# EAGLE design Kube_LoRaWAN_Module (EAGLE 9.6.2)
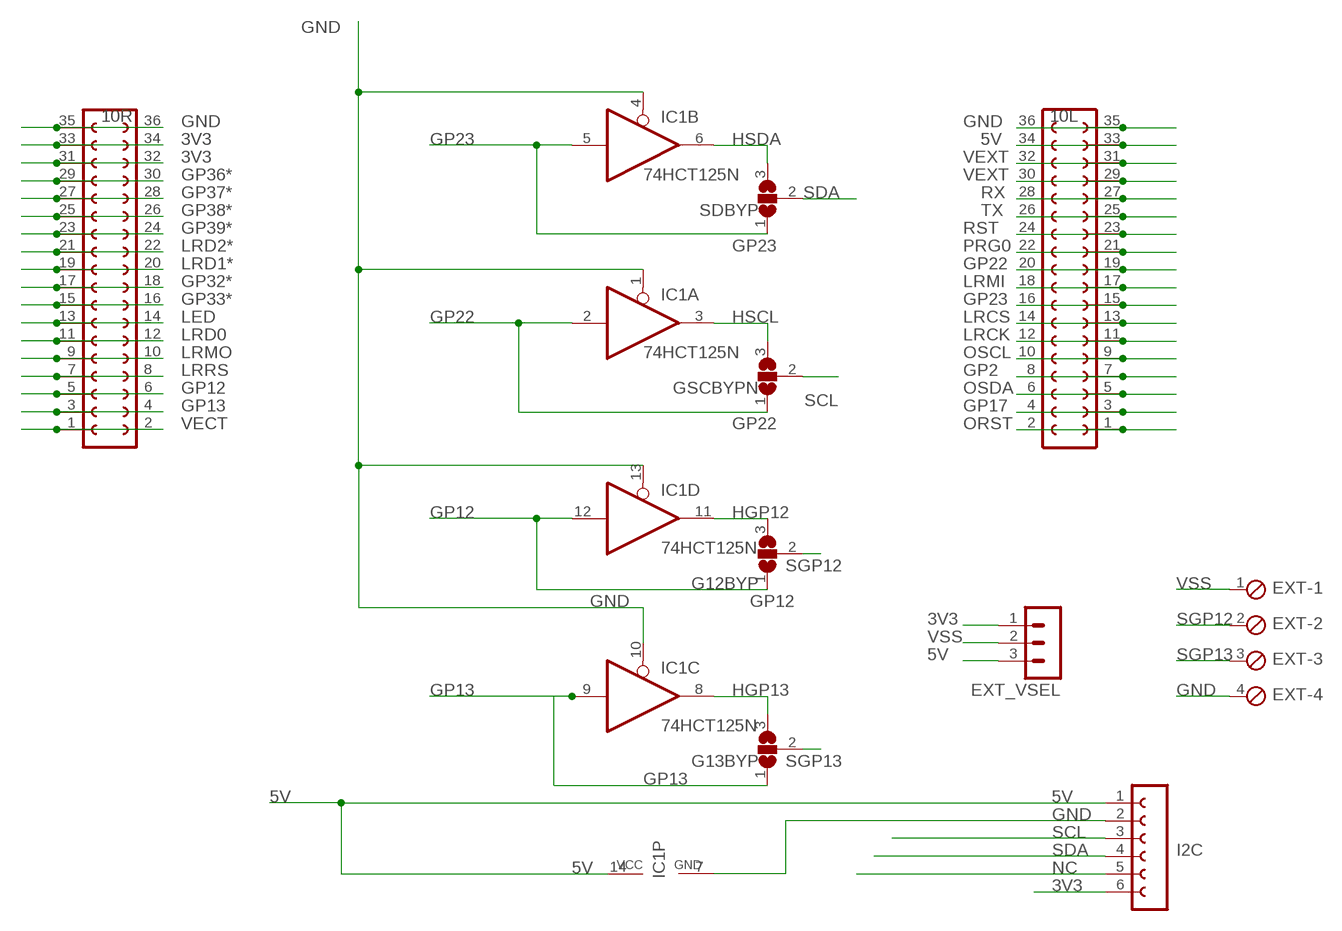
[diagram p0: schematic, sheet 1]

## Parts
10L  15  FE18-2  [FE18-2]
10R  15  FE18-2  [FE18-2]
EXT  MPT4  [4POL254]
EXT_VSEL  MA03-1  [MA03-1]
G12BYP  SJ2W  [SJ_2]
G13BYP  SJ2W  [SJ_2]
GSCBYPN  SJ2W  [SJ_2]
I2C  FE06-1  [FE06]
IC1  74HCT125N  [DIL14]
SDBYP  SJ2W  [SJ_2]

## Nets
3V3: 10R.31 10R.32 10R.33 10R.34 EXT_VSEL.1 I2C.6
5V: 10L.33 10L.34 EXT_VSEL.3 I2C.1 IC1.14(P:VCC)
GND: 10L.35 10L.36 10R.35 10R.36 EXT.4 I2C.2 IC1.1(A:OE) IC1.4(B:OE) IC1.7(P:GND) IC1.10(C:OE) IC1.13(D:OE)
GP2: 10L.7 10L.8
GP12: 10R.5 10R.6 G12BYP.1 IC1.12(D:I)
GP13: 10R.3 10R.4 G13BYP.1 IC1.9(C:I)
GP17: 10L.3 10L.4
GP22: 10L.19 10L.20 GSCBYPN.1 IC1.2(A:I)
GP23: 10L.15 10L.16 IC1.5(B:I) SDBYP.1
GP32*: 10R.17 10R.18
GP33*: 10R.15 10R.16
GP36*: 10R.29 10R.30
GP37*: 10R.27 10R.28
GP38*: 10R.25 10R.26
GP39*: 10R.23 10R.24
HGP12: G12BYP.3 IC1.11(D:O)
HGP13: G13BYP.3 IC1.8(C:O)
HSCL: GSCBYPN.3 IC1.3(A:O)
HSDA: IC1.6(B:O) SDBYP.3
LED: 10R.13 10R.14
LRCK: 10L.11 10L.12
LRCS: 10L.13 10L.14
LRD0: 10R.11 10R.12
LRD1*: 10R.19 10R.20
LRD2*: 10R.21 10R.22
LRMI: 10L.17 10L.18
LRMO: 10R.9 10R.10
LRRS: 10R.7 10R.8
NC: I2C.5
ORST: 10L.1 10L.2
OSCL: 10L.9 10L.10
OSDA: 10L.5 10L.6
PRG0: 10L.21 10L.22
RST: 10L.23 10L.24
RX: 10L.27 10L.28
SCL: GSCBYPN.2 I2C.3
SDA: I2C.4 SDBYP.2
SGP12: EXT.2 G12BYP.2
SGP13: EXT.3 G13BYP.2
TX: 10L.25 10L.26
VECT: 10R.1 10R.2
VEXT: 10L.29 10L.30 10L.31 10L.32
VSS: EXT.1 EXT_VSEL.2

## Library data of the parts
10L 10R = con-lsta:FE18-2: FEMALE HEADER; OC_FARNELL: unknown; OC_NEWARK: unknown
EXT = con-phoenix-254:MPT4: PHOENIX CONNECTOR; OC_FARNELL: unknown; OC_NEWARK: unknown
EXT_VSEL = con-lstb:MA03-1: PIN HEADER; OC_FARNELL: unknown; OC_NEWARK: unknown
G12BYP G13BYP GSCBYPN SDBYP = jumper:SJ2W: SMD solder JUMPER
I2C = con-lsta:FE06-1: FEMALE HEADER; OC_FARNELL: unknown; OC_NEWARK: unknown
IC1 = 74xx-eu:74*125: Quad bus BUFFER, 3-state

## Board
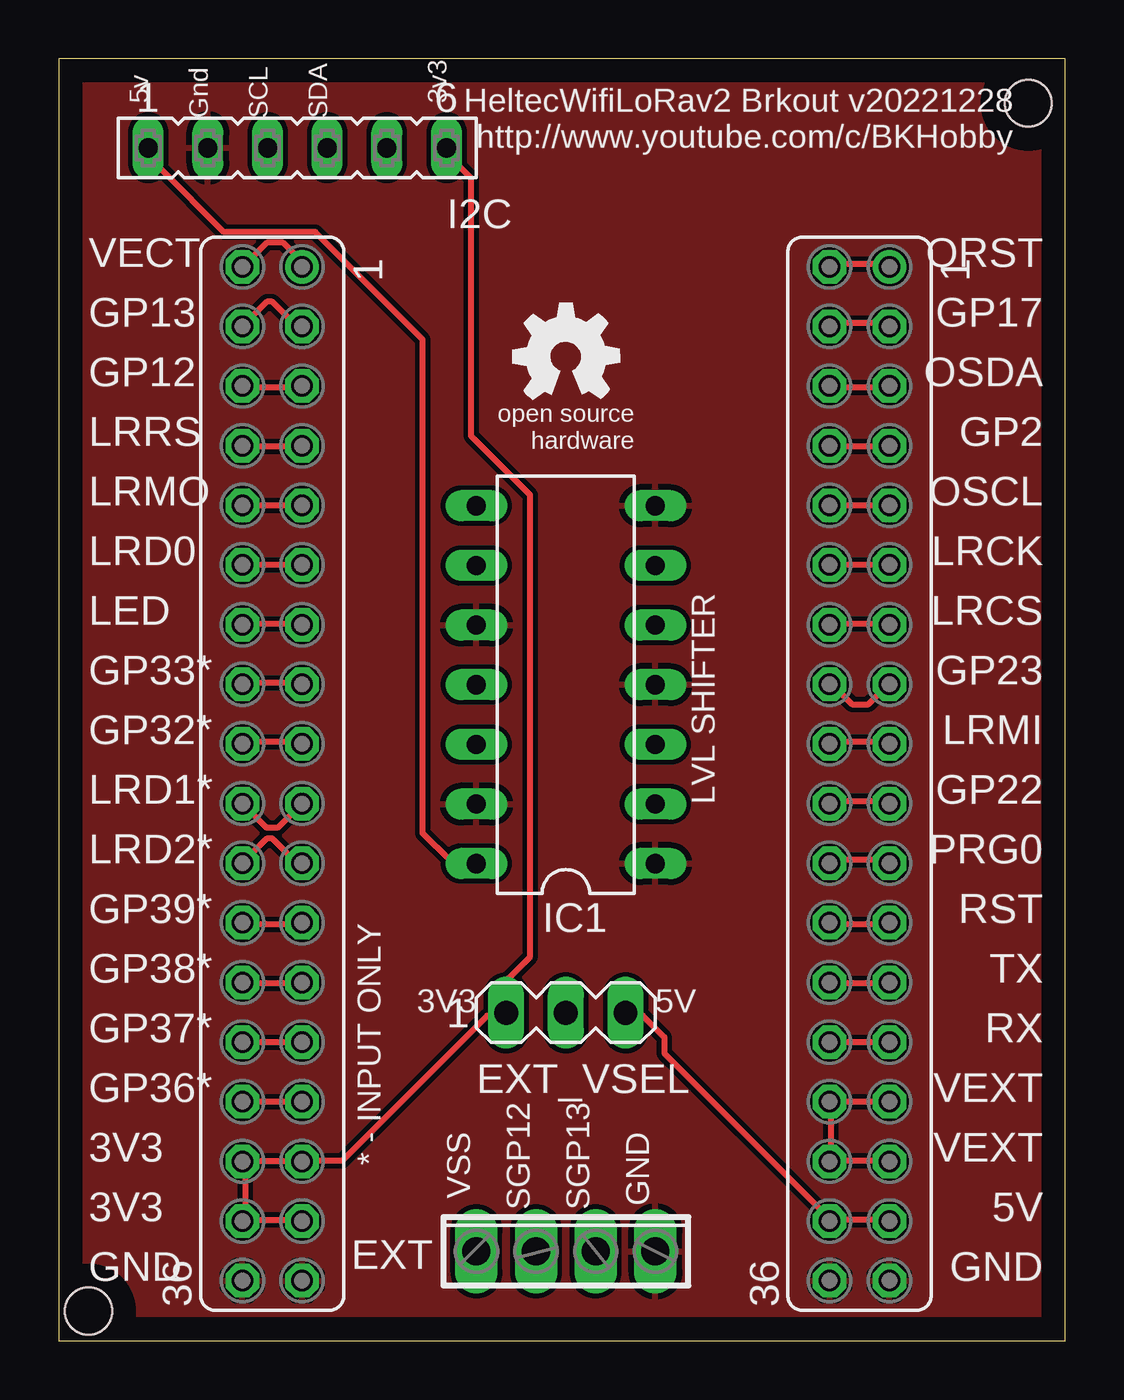
[diagram p1: board, top side]
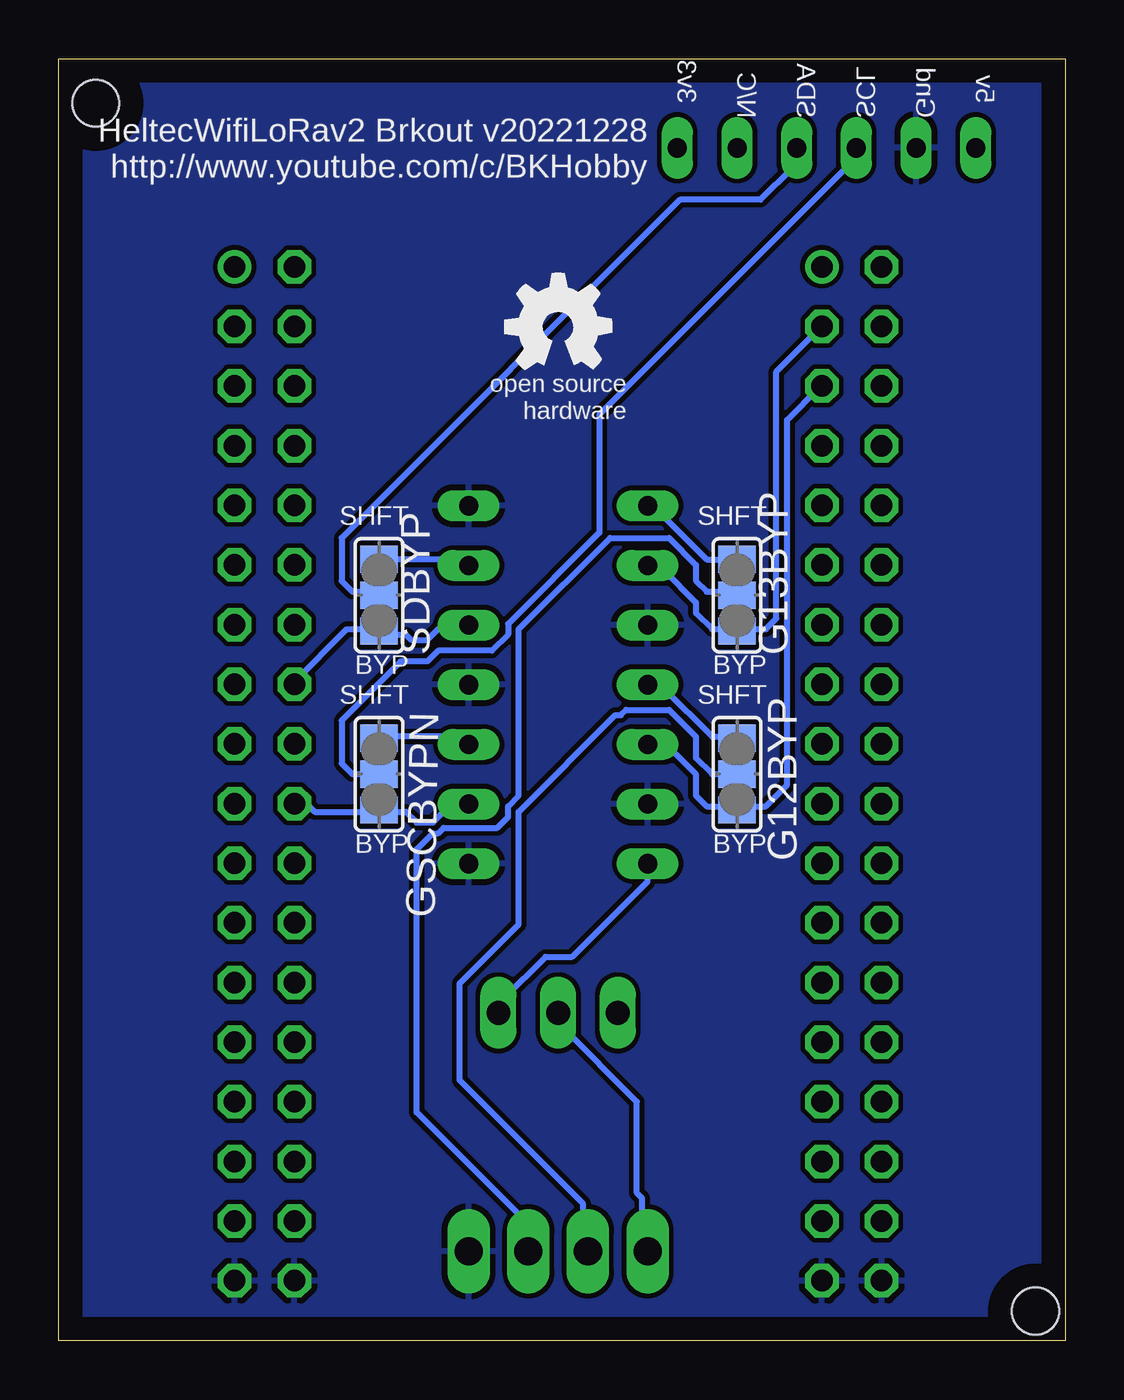
[diagram p2: board, bottom side, seen from below]

Size 42.85 x 54.6 mm. Coordinates in mm from the lower left corner, seen from the top.
Outline: 0,0 42.85,0 42.85,54.6 0,54.6 0,0
Copper layers (1*16): Top 0.035mm / dielectric 1.5mm / Bottom 0.035mm
Design rules "default": minimum track width 10mil, minimum drill 24mil, track to track 8mil, track to pad 8mil, pad to pad 8mil, via to via 8mil, smd to smd 8mil, copper to edge 40mil, drill to drill 8mil, minimum pad ring 10mil, minimum via ring 8mil, stop-mask expansion 4mil, vias tented up to drill 0mil, thermal gap 10mil
Holes 2 mm at 41.27,52.7 1.27,1.27

### Footprints (pad centres in the part's own frame; a part is rotated, then mirrored left to right if it is on the bottom)
FE18-2 = drill 0.914: 1 -21.59,1.27 | drill 0.914 octagon: 2 -21.59,-1.27; 3 -19.05,1.27; 4 -19.05,-1.27; 5 -16.51,1.27; 6 -16.51,-1.27; 7 -13.97,1.27; 8 -13.97,-1.27; 9 -11.43,1.27; 10 -11.43,-1.27; 11 -8.89,1.27; 12 -8.89,-1.27; 13 -6.35,1.27; 14 -6.35,-1.27; 15 -3.81,1.27; 16 -3.81,-1.27; 17 -1.27,1.27; 18 -1.27,-1.27; 19 1.27,1.27; 20 1.27,-1.27; 21 3.81,1.27; 22 3.81,-1.27; 23 6.35,1.27; 24 6.35,-1.27; 25 8.89,1.27; 26 8.89,-1.27; 27 11.43,1.27; 28 11.43,-1.27; 29 13.97,1.27; 30 13.97,-1.27; 31 16.51,1.27; 32 16.51,-1.27; 33 19.05,1.27; 34 19.05,-1.27; 35 21.59,1.27; 36 21.59,-1.27
4POL254 = drill 1.2 long: 1 -3.81,0; 2 -1.27,0; 3 1.27,0; 4 3.81,0
MA03-1 = drill 1.016 long: 1 -2.54,0; 2 0,0; 3 2.54,0
SJ_2 = smd 1.168 x 1.6: 1 -1.524,0; 2 0,0; 3 1.524,0
FE06 = drill 0.813 long: 1 -6.35,0; 2 -3.81,0; 3 -1.27,0; 4 1.27,0; 5 3.81,0; 6 6.35,0
DIL14 = drill 0.813 long: 1 -7.62,-3.81; 2 -5.08,-3.81; 3 -2.54,-3.81; 4 0,-3.81; 5 2.54,-3.81; 6 5.08,-3.81; 7 7.62,-3.81; 8 7.62,3.81; 9 5.08,3.81; 10 2.54,3.81; 11 0,3.81; 12 -2.54,3.81; 13 -5.08,3.81; 14 -7.62,3.81

### Placement (x,y rotation side)
10L  34.09,24.15 270 top
10R  9.09,24.15 270 top
EXT  21.59,3.81 0 top
EXT_VSEL  21.59,13.97 0 top
G12BYP  13.97,24.13 90 bottom
G13BYP  13.97,31.75 90 bottom
GSCBYPN  29.21,24.13 90 bottom
I2C  10.16,50.8 0 top
IC1  21.59,27.94 90 top
SDBYP  29.21,31.75 90 bottom
U$1  [OSHW_5MM]  21.59,41.91 0 top
U$2  [OSHW_5MM]  21.59,43.18 0 bottom

### Tracks (layer width: path | path; a pad name or v marks a point on that pad's centre or on a via)
3V3
  Top 0.254: 7.95,5.16 7.95,7.44 10R.32 7.95,7.67 10.24,7.67 10R.31 10.46,7.67 12.06,7.67 18.24,13.84 18.92,13.84 EXT_VSEL.1 19.15,14.07 19.15,15.44 20.07,16.36 20.07,36.02 17.55,38.53 17.55,49.5 16.64,50.42 16.64,50.65 I2C.6 | 7.95,5.16 10.24,5.16 10R.33 | 7.95,5.16 10R.34
5V
  Top 0.254: 10L.33 35.15,5.16 32.87,5.16 10L.34 32.64,5.16 32.64,5.38 25.78,12.24 25.78,12.93 24.87,13.84 24.18,13.84 EXT_VSEL.3 | I2C.1 3.83,50.65 4.29,50.19 4.29,49.96 7.04,47.22 10.92,47.22 15.49,42.65 15.49,21.61 16.64,20.47 17.78,20.47 IC1.14
  Bottom 0.254: IC1.14 17.78,19.56 20.98,16.36 22.12,16.36 23.95,14.53 23.95,14.07 EXT_VSEL.3
GND
  pour Top: 0,0 0,54.61 43.18,54.61 43.18,0
  pour Bottom: 0,0 0,54.61 43.18,54.61 43.18,0
GP2
  Top 0.254: 10L.8 32.87,38.08 35.15,38.08 10L.7
GP12
  Top 0.254: 10R.6 7.95,40.59 10.24,40.59 10R.5
  Bottom 0.254: IC1.12 17.78,25.27 16.87,25.27 15.72,24.13 15.72,23.22 15.26,22.76 14.12,22.76 G12BYP.1 13.89,22.76 12.75,22.76 11.84,23.67 11.84,39.22 10.46,40.59 10R.5
GP13
  Top 0.254: 10R.4 7.95,43.33 8.86,44.25 9.09,44.25 10.24,43.1 10R.3
  Bottom 0.254: IC1.9 17.78,32.82 17.09,32.82 15.72,31.44 15.72,30.99 15.04,30.3 14.12,30.3 G13BYP.1 13.89,30.3 12.75,30.3 12.29,30.76 12.29,41.28 10.46,43.1 10R.3
GP17
  Top 0.254: 10L.4 32.87,43.33 35.15,43.33 10L.3
GP22
  Top 0.254: 10L.19 35.15,22.99 32.87,22.99 10L.20
  Bottom 0.254: 29.21,22.53 31.95,22.53 32.18,22.76 32.64,22.76 10L.20 | 29.21,22.53 28.07,22.53 27.61,22.07 26.92,22.07 26.24,22.76 25.55,22.76 IC1.2 | 29.21,22.53 GSCBYPN.1
GP23
  Top 0.254: 10L.15 35.15,27.79 34.47,27.1 33.78,27.1 32.87,28.02 10L.16
  Bottom 0.254: 10L.16 32.87,28.02 30.58,30.3 29.21,30.3 SDBYP.1 29.21,30.07 28.07,30.07 27.84,29.85 27.15,29.85 26.69,30.3 25.55,30.3 IC1.5
GP32*
  Top 0.254: 10R.18 7.95,25.5 10.24,25.5 10R.17
GP33*
  Top 0.254: 10R.16 7.95,28.02 10.24,28.02 10R.15
GP36*
  Top 0.254: 10R.30 7.95,10.18 10.24,10.18 10R.29
GP37*
  Top 0.254: 10R.28 7.95,12.7 10.24,12.7 10R.27
GP38*
  Top 0.254: 10R.26 7.95,15.21 10.24,15.21 10R.25
GP39*
  Top 0.254: 10R.24 7.95,17.73 10.24,17.73 10R.23
HGP12
  Bottom 0.254: G12BYP.3 14.12,25.73 15.04,25.73 17.09,27.79 17.78,27.79 IC1.11
HGP13
  Bottom 0.254: G13BYP.3 15.26,33.27 17.55,35.56 IC1.8
HSCL
  Bottom 0.254: GSCBYPN.3 29.21,25.73 25.78,25.73 25.55,25.5 IC1.3
HSDA
  Bottom 0.254: SDBYP.3 25.78,33.27 25.55,33.05 IC1.6
LED
  Top 0.254: 10R.14 7.95,30.53 10.24,30.53 10R.13
LRCK
  Top 0.254: 10L.12 32.87,33.05 35.15,33.05 10L.11
LRCS
  Top 0.254: 10L.14 32.87,30.53 35.15,30.53 10L.13
LRD0
  Top 0.254: 10R.12 7.95,33.05 10.24,33.05 10R.11
LRD1*
  Top 0.254: 10R.20 7.95,22.76 8.86,21.84 9.32,21.84 10.24,22.76 10R.19
LRD2*
  Top 0.254: 10R.22 7.95,20.47 8.86,21.39 9.09,21.39 10.24,20.24 10R.21
LRMI
  Top 0.254: 10L.18 32.87,25.5 35.15,25.5 10L.17
LRMO
  Top 0.254: 10R.10 7.95,35.56 10.24,35.56 10R.9
LRRS
  Top 0.254: 10R.8 7.95,38.08 10.24,38.08 10R.7
ORST
  Top 0.254: 10L.2 32.87,45.85 35.15,45.85 10L.1
OSCL
  Top 0.254: 10L.10 32.87,35.56 35.15,35.56 10L.9
OSDA
  Top 0.254: 10L.6 32.87,40.59 35.15,40.59 10L.5
PRG0
  Top 0.254: 10L.22 32.87,20.47 35.15,20.47 10L.21
RST
  Top 0.254: 10L.24 32.87,17.73 35.15,17.73 10L.23
RX
  Top 0.254: 10L.28 32.87,12.7 35.15,12.7 10L.27
SCL
  Bottom 0.254: GSCBYPN.2 30.35,24.13 30.81,24.59 30.81,26.42 28.3,28.93 27.15,28.93 26.69,29.39 24.41,29.39 23.72,30.07 23.72,30.53 19.84,34.42 19.84,39.45 9.09,50.19 9.09,50.65 I2C.3
SDA
  Bottom 0.254: SDBYP.2 29.21,31.9 30.35,31.9 30.81,32.36 30.81,34.19 16.41,48.59 12.98,48.59 11.61,49.96 11.61,50.65 I2C.4
SGP12
  Bottom 0.254: G12BYP.2 15.04,24.13 15.72,24.82 15.72,25.73 16.87,26.87 18.69,26.87 18.92,26.64 19.15,26.64 23.27,22.53 23.27,17.73 25.78,15.21 25.78,11.1 20.52,5.84 20.52,4.01 EXT.2
SGP13
  Bottom 0.254: G13BYP.2 14.12,31.9 15.26,31.9 15.72,32.36 15.72,33.05 16.87,34.19 19.38,34.19 23.27,30.3 23.27,23.22 23.72,22.76 23.72,22.3 24.18,21.84 26.47,21.84 26.69,21.61 26.92,21.61 27.61,20.93 27.61,9.73 23.04,5.16 23.04,4.01 EXT.3
TX
  Top 0.254: 10L.26 32.87,15.21 35.15,15.21 10L.25
VECT
  Top 0.254: 10R.2 7.95,45.85 8.86,46.76 9.55,46.76 10.46,45.85 10R.1
VEXT
  Top 0.254: 32.87,7.67 35.15,7.67 10L.31 | 10L.29 35.15,10.18 32.87,10.18 10L.30 32.87,9.96 32.87,7.67 | 32.87,7.67 10L.32
VSS
  Bottom 0.254: EXT_VSEL.2 21.44,13.84 21.44,13.39 18.24,10.18 18.24,6.3 18.01,6.07 18.01,4.24 17.78,4.01 EXT.1

### Text on the board
tNames: HeltecWifiLoRav2 Brkout v20221228 / http://www.youtube.com/c/BKHobby | 5v | 3v3 | Gnd | SCL | SDA | ORST | VECT | GP17 | GP13 | OSDA | GP12 | GP2 | LRRS | OSCL | LRMO | LRCK | LRD0 | LRCS | LED | GP23 | GP33* | LRMI | GP32* | GP22 | LRD1* | LVL SHIFTER | PRG0 | LRD2* | RST | GP39* | * - INPUT ONLY | TX | GP38* | 3V3 | 5V | RX | GP37* | VEXT | GP36* | SGP12 | SGP13 | VSS | GND | VEXT | 3V3 | 5V | 3V3 | GND | GND
bNames: 5v | 3v3 | Gnd | SCL | SDA | N/C | HeltecWifiLoRav2 Brkout v20221228 / http://www.youtube.com/c/BKHobby | SHFT | SHFT | BYP | BYP | SHFT | SHFT | BYP | BYP